# EAGLE design Teensy3.2_v2_peripherie (EAGLE 7.6.0)
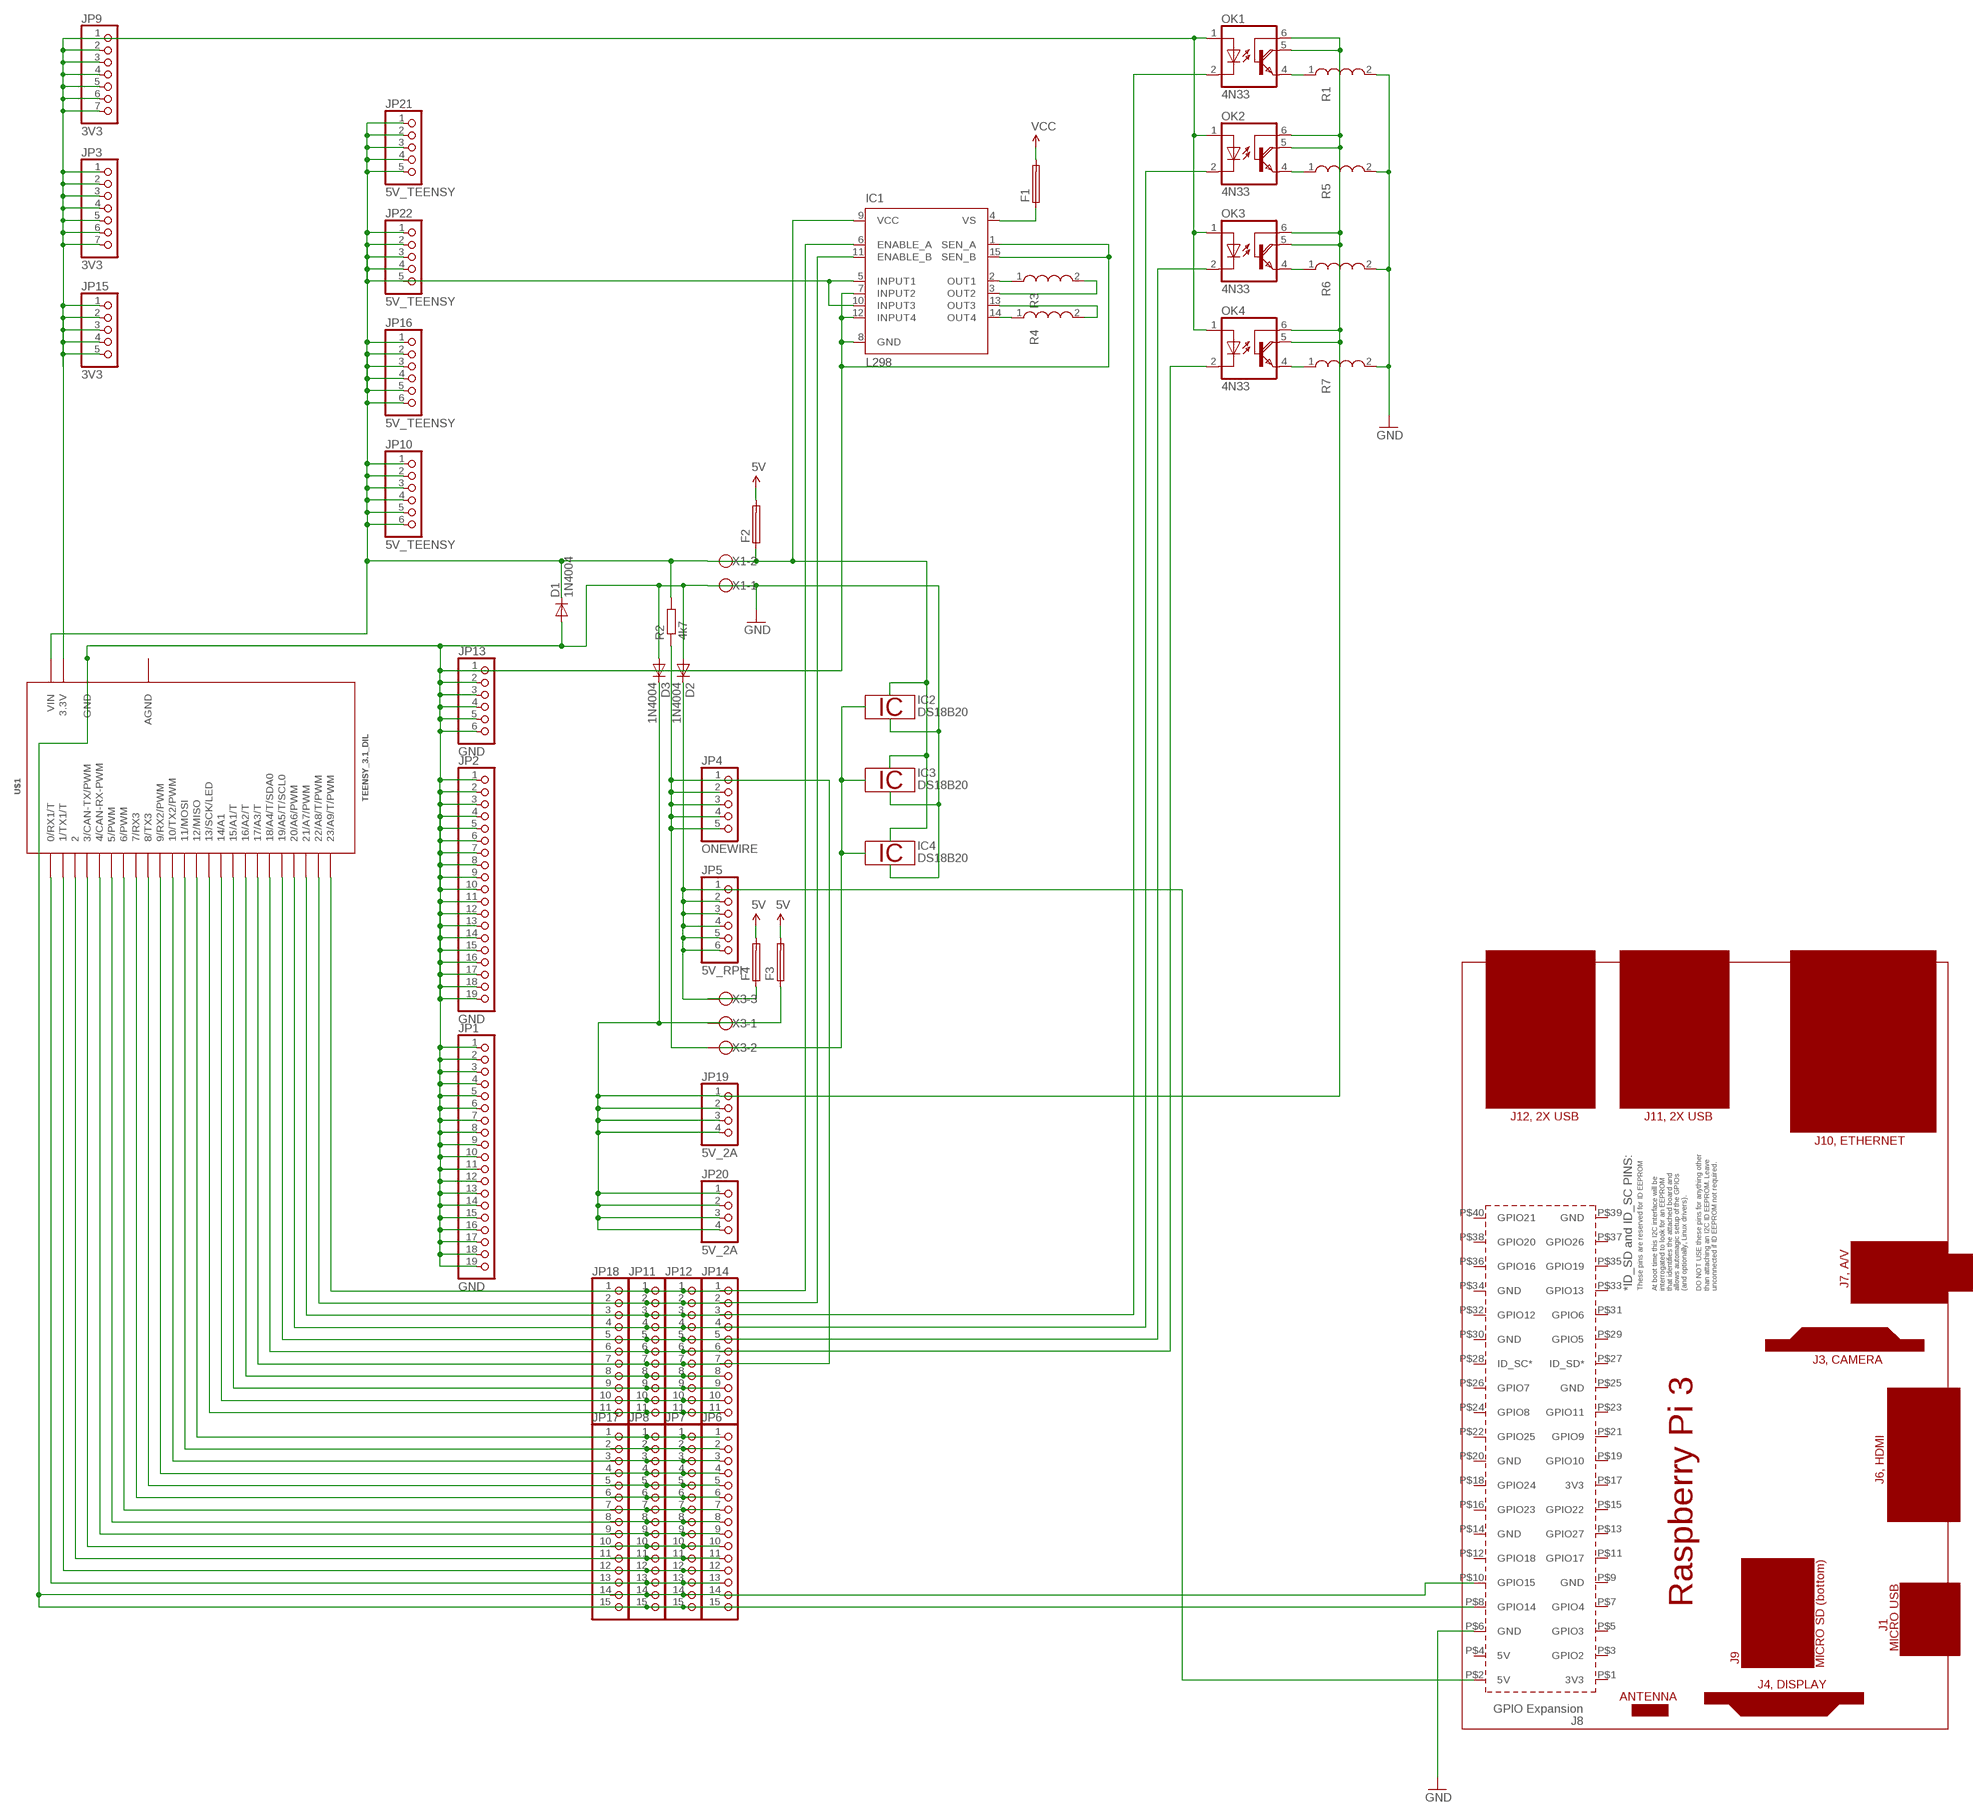
[diagram p0: schematic, sheet 1]

## Parts
D1  1N4004  [DO41-10]
D2  1N4004  [DO41-10]
D3  1N4004  [DO41-10]
F1  GSH15  [GSH15]
F2  GSH15  [GSH15]
F3  GSH15  [GSH15]
F4  GSH15  [GSH15]
IC1  L298  [MULTIWATT-15]
IC2  DS18B20  [TO92-]
IC3  DS18B20  [TO92-]
IC4  DS18B20  [TO92-]
JP1  GND  PINHD-1X19  [1X19]
JP2  GND  PINHD-1X19  [1X19]
JP3  3V3  PINHD-1X7  [1X07]
JP4  ONEWIRE  PINHD-1X5  [1X05]
JP5  5V_RPI  PINHD-1X6  [1X06]
JP6  PINHD-1X15  [1X15]
JP7  PINHD-1X15  [1X15]
JP8  PINHD-1X15  [1X15]
JP9  3V3  PINHD-1X7  [1X07]
JP10  5V_TEENSY  PINHD-1X6  [1X06]
JP11  PINHD-1X11  [1X11]
JP12  PINHD-1X11  [1X11]
JP13  GND  PINHD-1X6  [1X06]
JP14  PINHD-1X11  [1X11]
JP15  3V3  PINHD-1X5  [1X05]
JP16  5V_TEENSY  PINHD-1X6  [1X06]
JP17  PINHD-1X15  [1X15]
JP18  PINHD-1X11  [1X11]
JP19  5V_2A  PINHD-1X4  [1X04]
JP20  5V_2A  PINHD-1X4  [1X04]
JP21  5V_TEENSY  PINHD-1X5  [1X05]
JP22  5V_TEENSY  PINHD-1X5  [1X05]
OK1  4N33  [DIL06]
OK2  4N33  [DIL06]
OK3  4N33  [DIL06]
OK4  4N33  [DIL06]
PCB1  RPI3  [RPI3]
R1  SPULE_ALTERNATIV  [SPULE]
R2  4k7  R-EU_0204/5  [0204/5]
R3  SPULE_ALTERNATIV  [SPULE]
R4  SPULE_ALTERNATIV  [SPULE]
R5  SPULE_ALTERNATIV  [SPULE]
R6  SPULE_ALTERNATIV  [SPULE]
R7  SPULE_ALTERNATIV  [SPULE]
U$1  TEENSY_3.1_DIL  [TEENSY3-DIL]
X1  W237-102  [W237-102]
X3  W237-103  [W237-103]

## Nets
5V: F2.2 F3.2 F4.2
GND: D1.A D2.A D3.A IC1.1(SEN_A) IC1.7(INPUT2) IC1.8(GND) IC1.12(INPUT4) IC1.15(SEN_B) JP1.1 JP1.2 JP1.3 JP1.4 JP1.5 JP1.6 JP1.7 JP1.8 JP1.9 JP1.10 JP1.11 JP1.12 JP1.13 JP1.14 JP1.15 JP1.16 JP1.17 JP1.18 JP1.19 JP2.1 JP2.2 JP2.3 JP2.4 JP2.5 JP2.6 JP2.7 JP2.8 JP2.9 JP2.10 JP2.11 JP2.12 JP2.13 JP2.14 JP2.15 JP2.16 JP2.17 JP2.18 JP2.19 JP6.14 JP6.15 JP7.14 JP7.15 JP8.14 JP8.15 JP13.1 JP13.2 JP13.3 JP13.4 JP13.5 JP13.6 JP17.14 JP17.15 PCB1.P$6(GND) PCB1.P$8(GPIO14) PCB1.P$10(GPIO15) R1.2 R5.2 R6.2 R7.2 U$1.GND X1.1
N$1: JP4.1 JP4.2 JP4.3 JP4.4 JP4.5 JP11.7 JP12.7 JP14.7 JP18.7 R2.1 U$1.17/A3(17/A3/T) X3.2
N$2: JP3.1 JP3.2 JP3.3 JP3.4 JP3.5 JP3.6 JP3.7 JP9.1 JP9.2 JP9.3 JP9.4 JP9.5 JP9.6 JP9.7 JP15.1 JP15.2 JP15.3 JP15.4 JP15.5 OK1.1(A) OK2.1(A) OK3.1(A) OK4.1(A) U$1.3.3V
N$3: D3.C F3.1 JP19.1 JP19.2 JP19.3 JP19.4 JP20.1 JP20.2 JP20.3 JP20.4 OK1.5(COL) OK1.6(B) OK2.5(COL) OK2.6(B) OK3.5(COL) OK3.6(B) OK4.5(COL) OK4.6(B) X3.1
N$4: IC1.13(OUT3) R4.2
N$5: JP6.13 JP7.13 JP8.13 JP17.13 U$1.0(0/RX1/T)
N$7: JP6.11 JP7.11 JP8.11 JP17.11 U$1.2
N$8: JP6.10 JP7.10 JP8.10 JP17.10 U$1.3(3/CAN-TX/PWM)
N$9: JP6.9 JP7.9 JP8.9 JP17.9 U$1.4(4/CAN-RX-PWM)
N$10: JP6.8 JP7.8 JP8.8 JP17.8 U$1.5(5/PWM)
N$11: JP6.7 JP7.7 JP8.7 JP17.7 U$1.6(6/PWM)
N$12: JP6.6 JP7.6 JP8.6 JP17.6 U$1.7(7/RX3)
N$13: JP6.5 JP7.5 JP8.5 JP17.5 U$1.8(8/TX3)
N$14: JP6.4 JP7.4 JP8.4 JP17.4 U$1.9(9/RX2/PWM)
N$15: JP6.3 JP7.3 JP8.3 JP17.3 U$1.10(10/TX2/PWM)
N$16: JP6.2 JP7.2 JP8.2 JP17.2 U$1.11(11/MOSI)
N$17: IC1.14(OUT4) R4.1
N$18: JP6.1 JP7.1 JP8.1 JP17.1 U$1.12(12/MISO)
N$19: JP11.11 JP12.11 JP14.11 JP18.11 U$1.13(13/SCK/LED)
N$20: JP11.10 JP12.10 JP14.10 JP18.10 U$1.14/A0(14/A1)
N$21: JP11.9 JP12.9 JP14.9 JP18.9 U$1.15/A1(15/A1/T)
N$22: JP11.8 JP12.8 JP14.8 JP18.8 U$1.16/A2(16/A2/T)
N$23: D1.C F2.1 IC1.5(INPUT1) IC1.9(VCC) IC1.10(INPUT3) JP10.1 JP10.2 JP10.3 JP10.4 JP10.5 JP10.6 JP16.1 JP16.2 JP16.3 JP16.4 JP16.5 JP16.6 JP21.1 JP21.2 JP21.3 JP21.4 JP21.5 JP22.1 JP22.2 JP22.3 JP22.4 JP22.5 R2.2 U$1.VIN X1.2
N$24: JP11.6 JP12.6 JP14.6 JP18.6 OK4.2(C) U$1.18/A4(18/A4/T/SDA0)
N$25: IC1.3(OUT2) R3.2
N$26: JP11.5 JP12.5 JP14.5 JP18.5 OK3.2(C) U$1.19/A5(19/A5/T/SCL0)
N$27: JP11.4 JP12.4 JP14.4 JP18.4 OK2.2(C) U$1.20/A6(20/A6/PWM)
N$28: JP11.3 JP12.3 JP14.3 JP18.3 OK1.2(C) U$1.21/A7(21/A7/PWM)
N$29: IC1.11(ENABLE_B) JP11.2 JP12.2 JP14.2 JP18.2 U$1.22/A8(22/A8/T/PWM)
N$30: IC1.6(ENABLE_A) JP11.1 JP12.1 JP14.1 JP18.1 U$1.23/A9(23/A9/T/PWM)
N$32: JP6.12 JP7.12 JP8.12 JP17.12 U$1.1(1/TX1/T)
N$33: D2.C F4.1 JP5.1 JP5.2 JP5.3 JP5.4 JP5.5 JP5.6 PCB1.P$2(5V) X3.3
N$34: IC1.2(OUT1) R3.1
N$35: F1.1 IC1.4(VS)
N$39: OK1.4(E) R1.1
N$41: OK2.4(E) R5.1
N$42: OK3.4(E) R6.1
N$43: OK4.4(E) R7.1
VCC: F1.2
Unconnected: PCB1.P$1(3V3) PCB1.P$3(GPIO2) PCB1.P$4(5V) PCB1.P$5(GPIO3) PCB1.P$7(GPIO4) PCB1.P$9(GND) PCB1.P$11(GPIO17) PCB1.P$12(GPIO18) PCB1.P$13(GPIO27) PCB1.P$14(GND) PCB1.P$15(GPIO22) PCB1.P$16(GPIO23) PCB1.P$17(3V3) PCB1.P$18(GPIO24) PCB1.P$19(GPIO10) PCB1.P$20(GND) PCB1.P$21(GPIO9) PCB1.P$22(GPIO25) PCB1.P$23(GPIO11) PCB1.P$24(GPIO8) PCB1.P$25(GND) PCB1.P$26(GPIO7) PCB1.P$27(ID_SD*) PCB1.P$28(ID_SC*) PCB1.P$29(GPIO5) PCB1.P$30(GND) PCB1.P$31(GPIO6) PCB1.P$32(GPIO12) PCB1.P$33(GPIO13) PCB1.P$34(GND) PCB1.P$35(GPIO19) PCB1.P$36(GPIO16) PCB1.P$37(GPIO26) PCB1.P$38(GPIO20) PCB1.P$39(GND) PCB1.P$40(GPIO21)

## Power pins joined to a net without a drawn wire
1W: IC2.2 IC3.2 IC4.2
AGND: U$1.AGND
GND: IC2.1 IC3.1 IC4.1
VDD: IC2.3 IC3.3 IC4.3

## Library data of the parts
D1-D3 = diode:1N4004: DIODE general purpose rectifier, 1 A
F1-F4 = fuse:GSH15: FUSE HOLDER grid 15mm, 19649 Wickmann; MPN: 64900001039; OC_FARNELL: 1271673; OC_NEWARK: 02P0318
IC1 = st-microelectronics:L298: DUAL FULL-BRIDGE DRIVER; MPN: L298N; OC_FARNELL: 1589425; OC_NEWARK: 32M1527
IC2-IC4 = 1wire:DS18B20: Programmable Resolution Digital Thermometer This chip provides a onewire thermosensor with approx. 0.5°C accuracy. A programmable over/undertemperure alarm is available. The precision can be set from 9..12 bits. Notes: Vdd must be applied for accurate measurements at low temperatures, as the parasite power circuit otherwise heats the sensor. If parasite power is used, Vdd has to be connected to GND. The DS1822 is a low-cost thermometer chip, the DS18S20 is similar to the DS18B20, but with 9 Bit precision only. Author: Jan Kandziora <jjj@gmx.de>
JP1 JP2 = pinhead:PINHD-1X19: PIN HEADER
JP3 JP9 = pinhead:PINHD-1X7: PIN HEADER
JP4 JP15 JP21 JP22 = pinhead:PINHD-1X5: PIN HEADER
JP5 JP10 JP13 JP16 = pinhead:PINHD-1X6: PIN HEADER
JP6-JP8 JP17 = pinhead:PINHD-1X15: PIN HEADER
JP11 JP12 JP14 JP18 = pinhead:PINHD-1X11: PIN HEADER
JP19 JP20 = pinhead:PINHD-1X4: PIN HEADER
OK1-OK4 = optocoupler:4N33: MOTOROLA OPTO COUPLER; MF: VISHAY/TELEFUNKEN; MPN: 4N33; OC_FARNELL: 1469601; OC_NEWARK: 88K1390
PCB1 = e14_Rpi3_RevA:RPI3: Device for Raspberry Pi 3 board created by Dave Young for www.element14.com More information and support community is available at https://www.element14.com/community/community/raspberry-pi
R1 R3-R7 = e-spulen-transformatoren:SPULE_ALTERNATIV: Spule alternativ
R2 = rcl:R-EU_: RESISTOR, European symbol
U$1 = Teensy_3_and_LC_Series_Boards_v1.1:TEENSY_3.1_DIL: Teensy 3.1 or 3.2 in a DIL Layout.
X1 = con-wago-500:W237-102: WAGO SCREW CLAMP; MPN: 237-102; OC_FARNELL: unknown; OC_NEWARK: 70K9898
X3 = con-wago-500:W237-103: WAGO SCREW CLAMP; MPN: 237-103; OC_FARNELL: unknown; OC_NEWARK: 18M7116

## Board
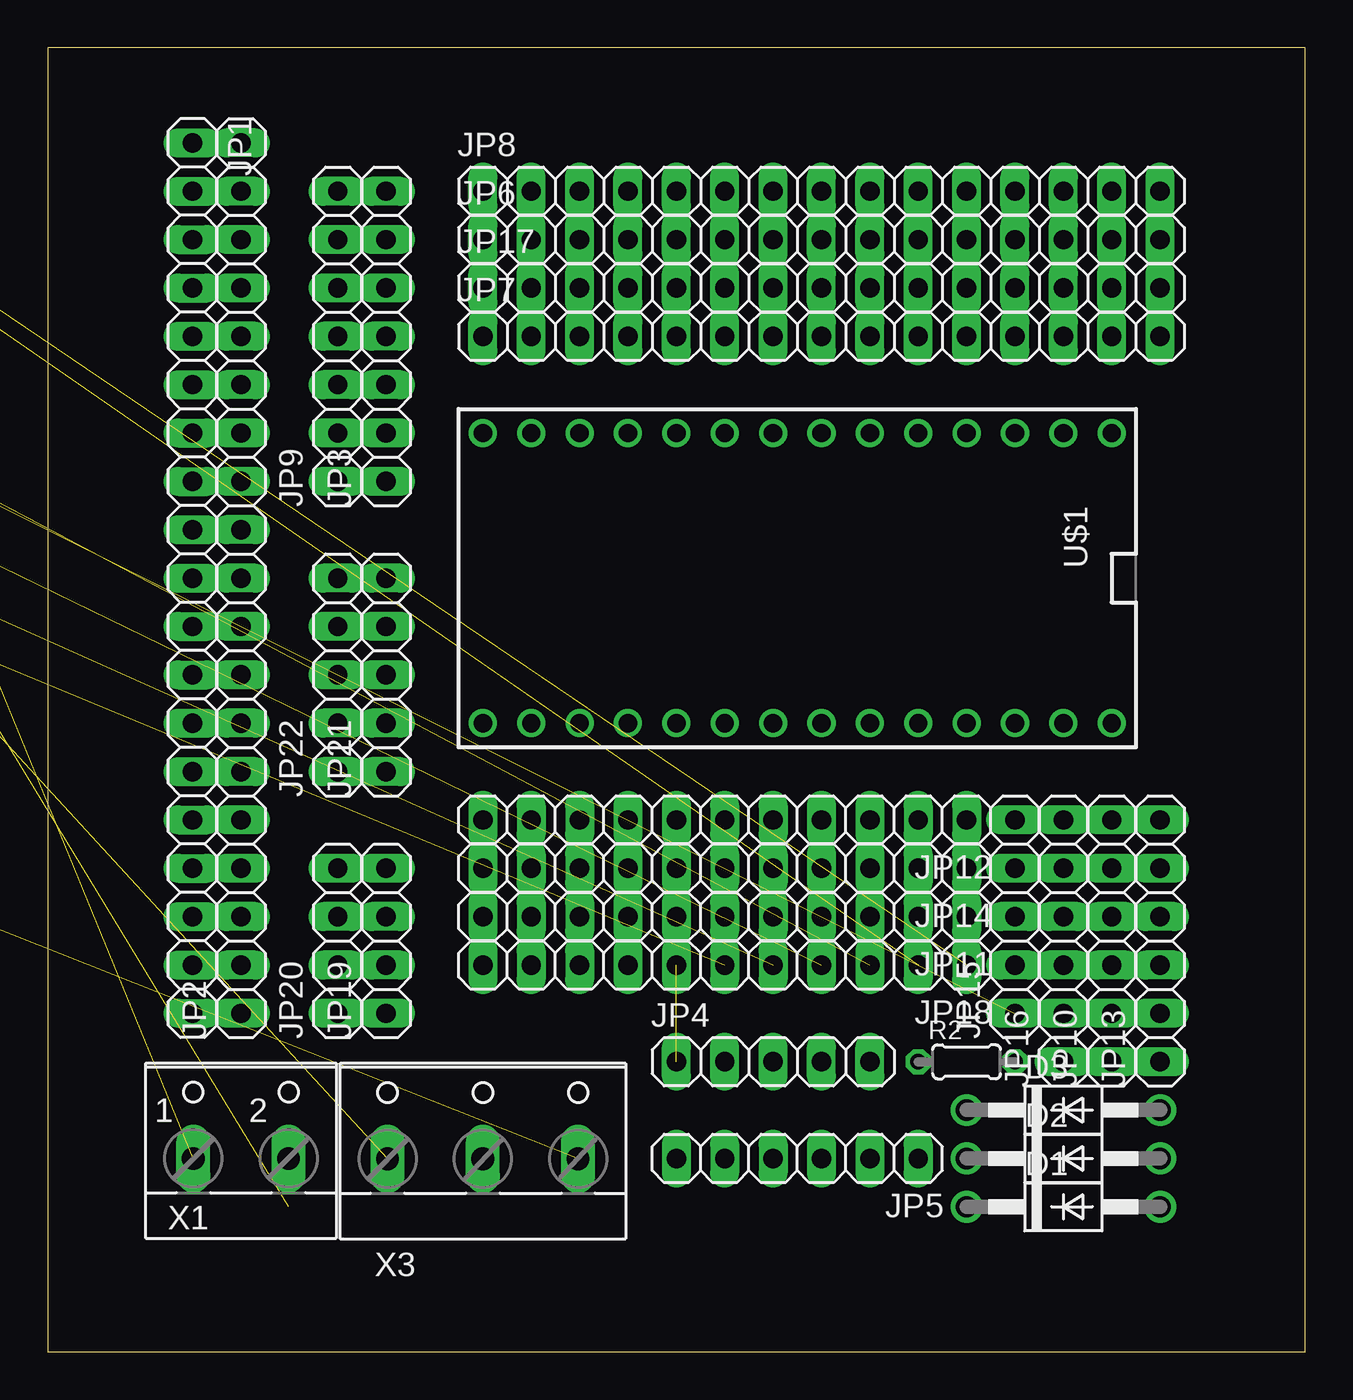
[diagram p1: board, top side]
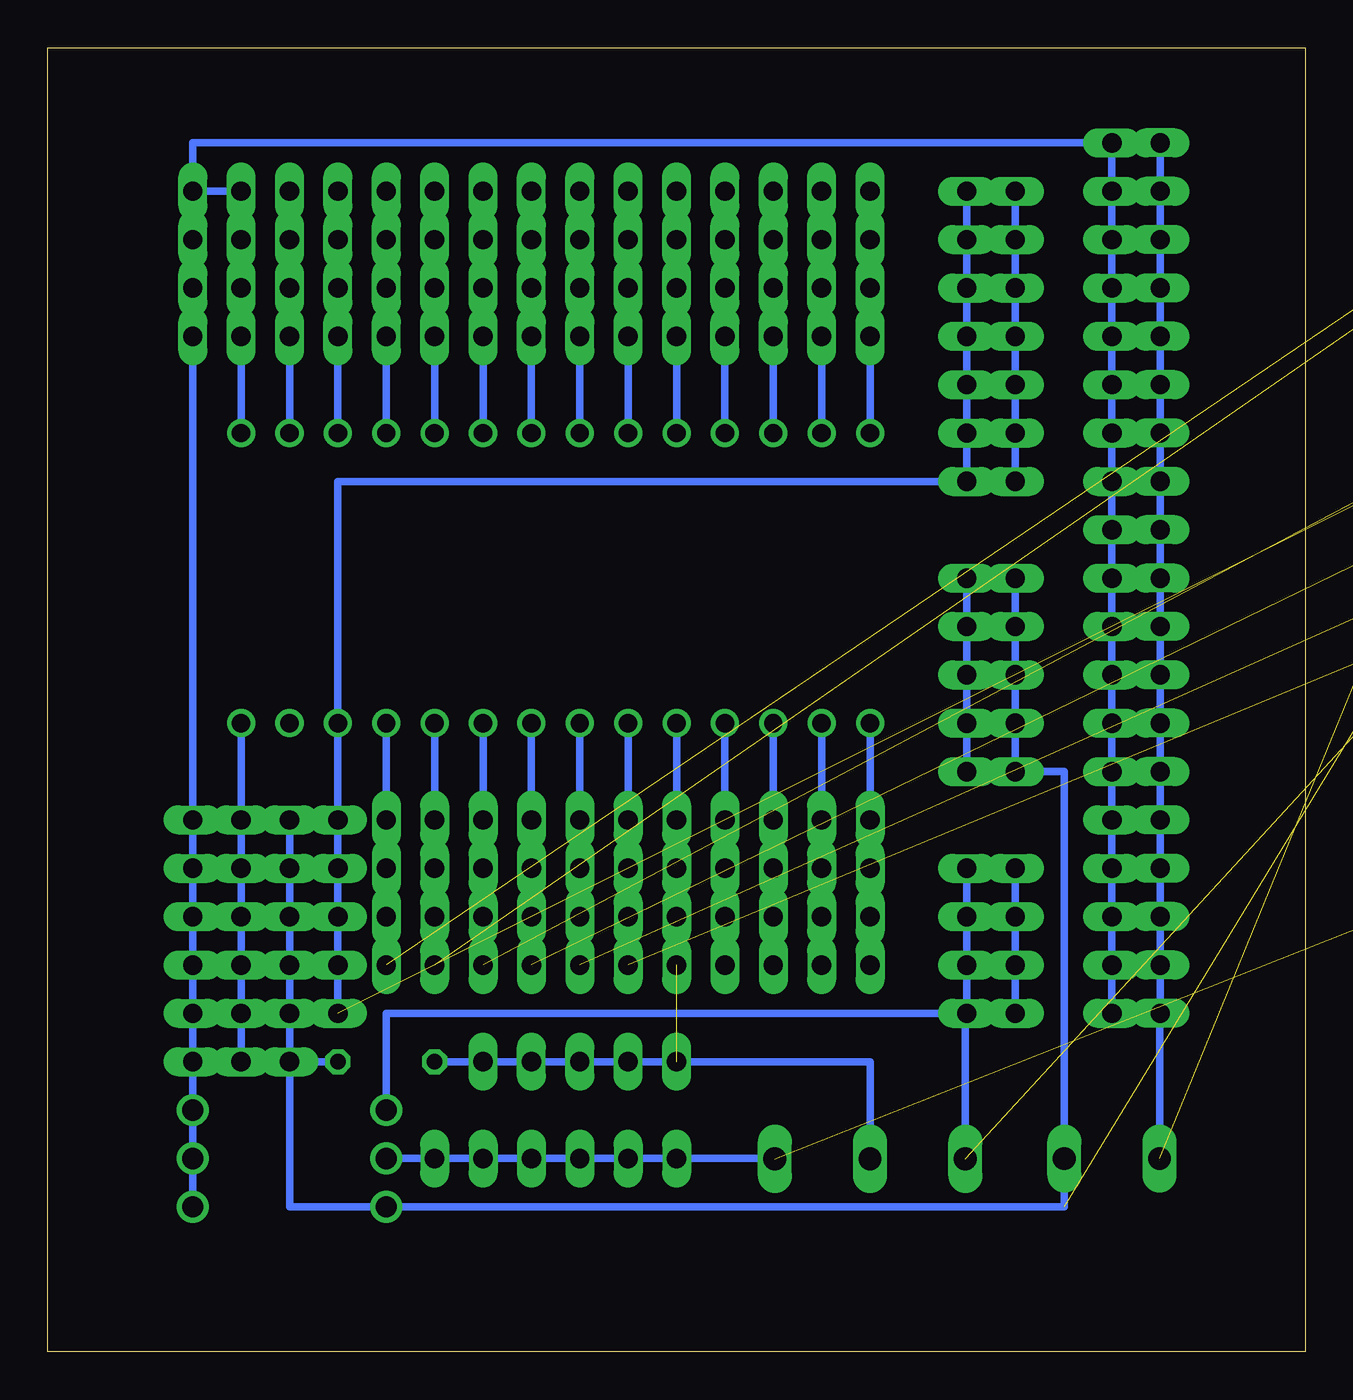
[diagram p2: board, bottom side, seen from below]

Size 66.03 x 68.5 mm. Coordinates in mm from the lower left corner, seen from the top.
Outline: 66.03,0 66.03,68.5 0,68.5 0,0 66.03,0
Copper layers (1*16): Top 0.035mm / dielectric 1.5mm / Bottom 0.035mm
Design rules "default": minimum track width 10mil, minimum drill 24mil, track to track 8mil, track to pad 8mil, pad to pad 8mil, via to via 8mil, smd to smd 8mil, copper to edge 40mil, drill to drill 8mil, minimum pad ring 10mil, minimum via ring 8mil, stop-mask expansion 4mil, vias tented up to drill 0mil, thermal gap 10mil

### Footprints (pad centres in the part's own frame; a part is rotated, then mirrored left to right if it is on the bottom)
DO41-10 = drill 1.118: A 5.08,0; C -5.08,0
GSH15 = drill 1.321 pad 2.54 long: 1 -7.62,0; 2 7.62,0 | hole 2.794: 0,0
MULTIWATT-15 = drill 1.2 long: 1 -8.89,-7.62; 2 -7.62,-2.54; 3 -6.35,-7.62; 4 -5.08,-2.54; 5 -3.81,-7.62; 6 -2.54,-2.54; 7 -1.27,-7.62; 8 0,-2.54; 9 1.27,-7.62; 10 2.54,-2.54; 11 3.81,-7.62; 12 5.08,-2.54; 13 6.35,-7.62; 14 7.62,-2.54; 15 8.89,-7.62
TO92- = drill 0.813 octagon: 1 -2.54,0; 2 0,0; 3 2.54,0
1X19 = drill 1.016 long: 1 -22.86,0; 2 -20.32,0; 3 -17.78,0; 4 -15.24,0; 5 -12.7,0; 6 -10.16,0; 7 -7.62,0; 8 -5.08,0; 9 -2.54,0; 10 0,0; 11 2.54,0; 12 5.08,0; 13 7.62,0; 14 10.16,0; 15 12.7,0; 16 15.24,0; 17 17.78,0; 18 20.32,0; 19 22.86,0
1X07 = drill 1.016 long: 1 -7.62,0; 2 -5.08,0; 3 -2.54,0; 4 0,0; 5 2.54,0; 6 5.08,0; 7 7.62,0
1X05 = drill 1.016 long: 1 -5.08,0; 2 -2.54,0; 3 0,0; 4 2.54,0; 5 5.08,0
1X06 = drill 1.016 long: 1 -6.35,0; 2 -3.81,0; 3 -1.27,0; 4 1.27,0; 5 3.81,0; 6 6.35,0
1X15 = drill 1.016 long: 1 -17.78,0; 2 -15.24,0; 3 -12.7,0; 4 -10.16,0; 5 -7.62,0; 6 -5.08,0; 7 -2.54,0; 8 0,0; 9 2.54,0; 10 5.08,0; 11 7.62,0; 12 10.16,0; 13 12.7,0; 14 15.24,0; 15 17.78,0
1X11 = drill 1.016 long: 1 -12.7,0; 2 -10.16,0; 3 -7.62,0; 4 -5.08,0; 5 -2.54,0; 6 0,0; 7 2.54,0; 8 5.08,0; 9 7.62,0; 10 10.16,0; 11 12.7,0
1X04 = drill 1.016 long: 1 -3.81,0; 2 -1.27,0; 3 1.27,0; 4 3.81,0
DIL06 = drill 0.813 offset: 1 -2.54,-3.81; 2 0,-3.81; 3 2.54,-3.81; 4 2.54,3.81; 5 0,3.81; 6 -2.54,3.81
RPI3 = drill 1.016 square: P$1 8.37,51.23 | drill 1.016: P$2 8.357,53.772; P$3 10.897,51.232; P$4 10.897,53.772; P$5 13.437,51.232; P$6 13.437,53.772; P$7 15.977,51.232; P$8 15.977,53.772; P$9 18.517,51.232; P$10 18.517,53.772; P$11 21.057,51.232; P$12 21.057,53.772; P$13 23.597,51.232; P$14 23.597,53.772; P$15 26.137,51.232; P$16 26.137,53.772; P$17 28.677,51.232; P$18 28.677,53.772; P$19 31.217,51.232; P$20 31.217,53.772; P$21 33.757,51.232; P$22 33.757,53.772; P$23 36.297,51.232; P$24 36.297,53.772; P$25 38.837,51.232; P$26 38.837,53.772; P$27 41.377,51.232; P$28 41.377,53.772; P$29 43.917,51.232; P$30 43.917,53.772; P$31 46.457,51.232; P$32 46.457,53.772; P$33 48.997,51.232; P$34 48.997,53.772; P$35 51.537,51.232; P$36 51.537,53.772; P$37 54.077,51.232; P$38 54.077,53.772; P$39 56.617,51.232; P$40 56.617,53.772 | hole 2.75: 3.5,3.5; 61.5,3.5; 3.5,52.5; 61.5,52.5
SPULE = drill 0.2 pad 0.6 square: 1 0,2.54; 2 0,-2.54
0204/5 = drill 0.813 octagon: 1 -2.54,0; 2 2.54,0
TEENSY3-DIL = drill 0.965: 0 -7.62,13.97; 1 -7.62,11.43; 2 -7.62,8.89; 3 -7.62,6.35; 3.3V 7.62,11.43; 4 -7.62,3.81; 5 -7.62,1.27; 6 -7.62,-1.27; 7 -7.62,-3.81; 8 -7.62,-6.35; 9 -7.62,-8.89; 10 -7.62,-11.43; 11 -7.62,-13.97; 12 -7.62,-16.51; 13 7.62,-16.51; 14/A0 7.62,-13.97; 15/A1 7.62,-11.43; 16/A2 7.62,-8.89; 17/A3 7.62,-6.35; 18/A4 7.62,-3.81; 19/A5 7.62,-1.27; 20/A6 7.62,1.27; 21/A7 7.62,3.81; 22/A8 7.62,6.35; 23/A9 7.62,8.89; AGND 7.62,13.97; GND -7.62,16.51; VIN 7.62,16.51
W237-102 = drill 1.194 long: 1 -2.5,-1.27; 2 2.5,-1.27
W237-103 = drill 1.194 long: 1 -5,-1.29; 2 0,-1.29; 3 5,-1.29

### Placement (x,y rotation side)
D1  53.33,7.62 0 top
D2  53.33,10.16 0 top
D3  53.33,12.7 0 top
F1  -102.88,64.77 0 top  (outside the outline)
F2  -25.41,81.28 0 top  (outside the outline)
F3  -50.81,81.28 0 top  (outside the outline)
F4  -76.21,81.28 0 top  (outside the outline)
IC1  -24.14,73.66 0 top  (outside the outline)
IC2  -105.42,80.01 0 top  (outside the outline)
IC3  -114.31,80.01 0 top  (outside the outline)
IC4  -19.06,91.44 0 top  (outside the outline)
JP1  7.61,40.64 270 top
JP2  10.15,40.64 90 top
JP3  17.77,53.34 90 top
JP4  38.09,15.24 0 top
JP5  39.36,10.16 180 top
JP6  40.63,58.42 0 top
JP7  40.63,53.34 0 top
JP8  40.63,60.96 0 top
JP9  15.23,53.34 90 top
JP10  55.87,21.59 90 top
JP11  35.55,22.86 180 top
JP12  35.55,27.94 180 top
JP13  58.41,21.59 90 top
JP14  35.55,25.4 180 top
JP15  50.79,22.86 90 top
JP16  53.33,21.59 90 top
JP17  40.63,55.88 0 top
JP18  35.55,20.32 180 top
JP19  17.77,21.59 90 top
JP20  15.23,21.59 90 top
JP21  17.77,35.56 90 top
JP22  15.23,35.56 90 top
OK1  -38.11,67.31 0 top  (outside the outline)
OK2  -48.27,67.31 0 top  (outside the outline)
OK3  -58.43,67.31 0 top  (outside the outline)
OK4  -68.59,67.31 0 top  (outside the outline)
PCB1  -100.34,3.81 0 top  (outside the outline)
R1  -93.99,107.95 0 top  (outside the outline)
R2  48.25,15.24 0 top
R3  -96.53,107.95 0 top  (outside the outline)
R4  -99.07,107.95 0 top  (outside the outline)
R5  -101.61,107.95 0 top  (outside the outline)
R6  -104.15,107.95 0 top  (outside the outline)
R7  -106.69,107.95 0 top  (outside the outline)
U$1  39.36,40.64 270 top
X1  10.15,11.43 0 top
X3  22.85,11.43 0 top

### Tracks (layer width: path | path; a pad name or v marks a point on that pad's centre or on a via)
1W  (2 unrouted)
5V  (2 unrouted)
GND  (15 unrouted)
  Bottom 0.406: D3.A D2.A D1.A JP13.1 JP13.2 JP13.3 | 58.41,21.59 JP13.3 | JP13.3 JP13.4 JP13.5 JP13.6 JP7.15 JP17.15 JP6.15 JP8.15 | JP8.15 JP8.14 JP6.14 JP17.14 JP7.14 U$1.GND | JP8.15 58.41,63.5 JP2.19 | 7.61,10.16 X1.1 7.65,17.78 JP1.19 JP1.18 JP1.17 JP1.16 JP1.15 JP1.14 JP1.13 JP1.12 JP1.11 JP1.10 JP1.9 JP1.8 JP1.7 JP1.6 JP1.5 JP1.4 JP1.3 JP1.2 JP1.1 JP2.19 | JP2.1 JP2.2 JP2.3 JP2.4 JP2.5 JP2.6 JP2.7 JP2.8 JP2.9 JP2.10 JP2.11 JP2.12 JP2.13 | JP2.13 JP2.14 JP2.15 JP2.16 JP2.17 JP2.18 JP2.19 | JP2.13 JP2.19
N$1  (1 unrouted)
  Bottom 0.406: X3.2 22.85,15.24 JP4.1 JP4.2 JP4.3 JP4.4 JP4.5 R2.1 | JP18.7 JP11.7 JP14.7 JP12.7 U$1.17/A3
N$2  (4 unrouted)
  Bottom 0.406: JP9.1 JP9.2 JP9.3 JP9.4 JP9.5 JP9.6 JP9.7 JP3.7 JP3.6 JP3.5 JP3.4 JP3.3 JP3.2 JP3.1 50.79,45.72 U$1.3.3V JP15.5 JP15.4 JP15.3 JP15.2 JP15.1
N$3  (9 unrouted)
  Bottom 0.406: X3.1 17.85,17.78 JP19.1 | JP19.1 JP19.2 JP19.3 JP19.4 | JP19.1 JP20.1 JP20.2 JP20.4 JP20.3 | D3.C 48.25,17.78 JP19.1
N$4  (1 unrouted)
N$5
  Bottom 0.406: U$1.0 JP7.13 JP17.13 JP6.13 JP8.13
N$7
  Bottom 0.406: JP8.11 JP6.11 JP17.11 JP7.11 U$1.2
N$8
  Bottom 0.406: U$1.3 JP7.10 JP17.10 JP6.10 JP8.10
N$9
  Bottom 0.406: JP8.9 JP6.9 JP17.9 JP7.9 U$1.4
N$10
  Bottom 0.406: U$1.5 JP7.8 JP17.8 JP6.8 JP8.8
N$11
  Bottom 0.406: JP8.7 JP6.7 JP17.7 JP7.7 U$1.6
N$12
  Bottom 0.406: U$1.7 JP7.6 JP17.6 JP6.6 JP8.6
N$13
  Bottom 0.406: U$1.8 JP7.5 JP17.5 JP6.5 JP8.5
N$14
  Bottom 0.406: JP8.4 JP6.4 JP17.4 JP7.4 U$1.9
N$15
  Bottom 0.406: U$1.10 JP7.3 JP17.3 JP6.3 JP8.3
N$16
  Bottom 0.406: JP8.2 JP6.2 JP17.2 JP7.2 U$1.11
N$17  (1 unrouted)
N$18
  Bottom 0.406: U$1.12 JP7.1 JP17.1 JP6.1 JP8.1
N$19
  Bottom 0.406: JP18.11 JP11.11 JP14.11 JP12.11 U$1.13
N$20
  Bottom 0.406: U$1.14/A0 JP12.10 JP14.10 JP11.10 JP18.10
N$21
  Bottom 0.406: JP18.9 JP11.9 JP14.9 JP12.9 U$1.15/A1
N$22
  Bottom 0.406: U$1.16/A2 JP12.8 JP14.8 JP11.8 JP18.8
N$23  (4 unrouted)
  Bottom 0.406: JP21.1 JP21.2 JP21.3 JP21.4 JP21.5 JP22.5 JP22.4 JP22.3 JP22.2 JP22.1 12.65,30.48 X1.2 12.65,7.62 D1.C 53.33,7.62 JP16.1 | U$1.VIN JP10.6 JP10.5 JP10.4 | 57.14,22.86 JP10.4 | JP10.4 JP10.3 JP10.2 JP10.1 JP16.1 | JP16.1 JP16.2 JP16.3 JP16.4 JP16.5 JP16.6 | JP16.1 R2.2
N$24  (1 unrouted)
  Bottom 0.406: U$1.18/A4 JP12.6 JP14.6 JP11.6 JP18.6
N$25  (1 unrouted)
N$26  (1 unrouted)
  Bottom 0.406: JP18.5 JP11.5 JP14.5 JP12.5 U$1.19/A5
N$27  (1 unrouted)
  Bottom 0.406: U$1.20/A6 JP12.4 JP14.4 JP11.4 JP18.4
N$28  (1 unrouted)
  Bottom 0.406: JP18.3 JP11.3 JP14.3 JP12.3 U$1.21/A7
N$29  (1 unrouted)
  Bottom 0.406: U$1.22/A8 JP12.2 JP14.2 JP11.2 JP18.2
N$30  (1 unrouted)
  Bottom 0.406: JP18.1 JP11.1 JP14.1 JP12.1 U$1.23/A9
N$32
  Bottom 0.406: U$1.1 JP7.12 JP17.12 JP6.12 JP8.12
N$33  (2 unrouted)
  Bottom 0.406: X3.3 27.85,10.16 JP5.6 JP5.5 JP5.4 JP5.3 JP5.2 JP5.1 D2.C
N$34  (1 unrouted)
N$35  (1 unrouted)
N$39  (1 unrouted)
N$41  (1 unrouted)
N$42  (1 unrouted)
N$43  (1 unrouted)
VDD  (2 unrouted)